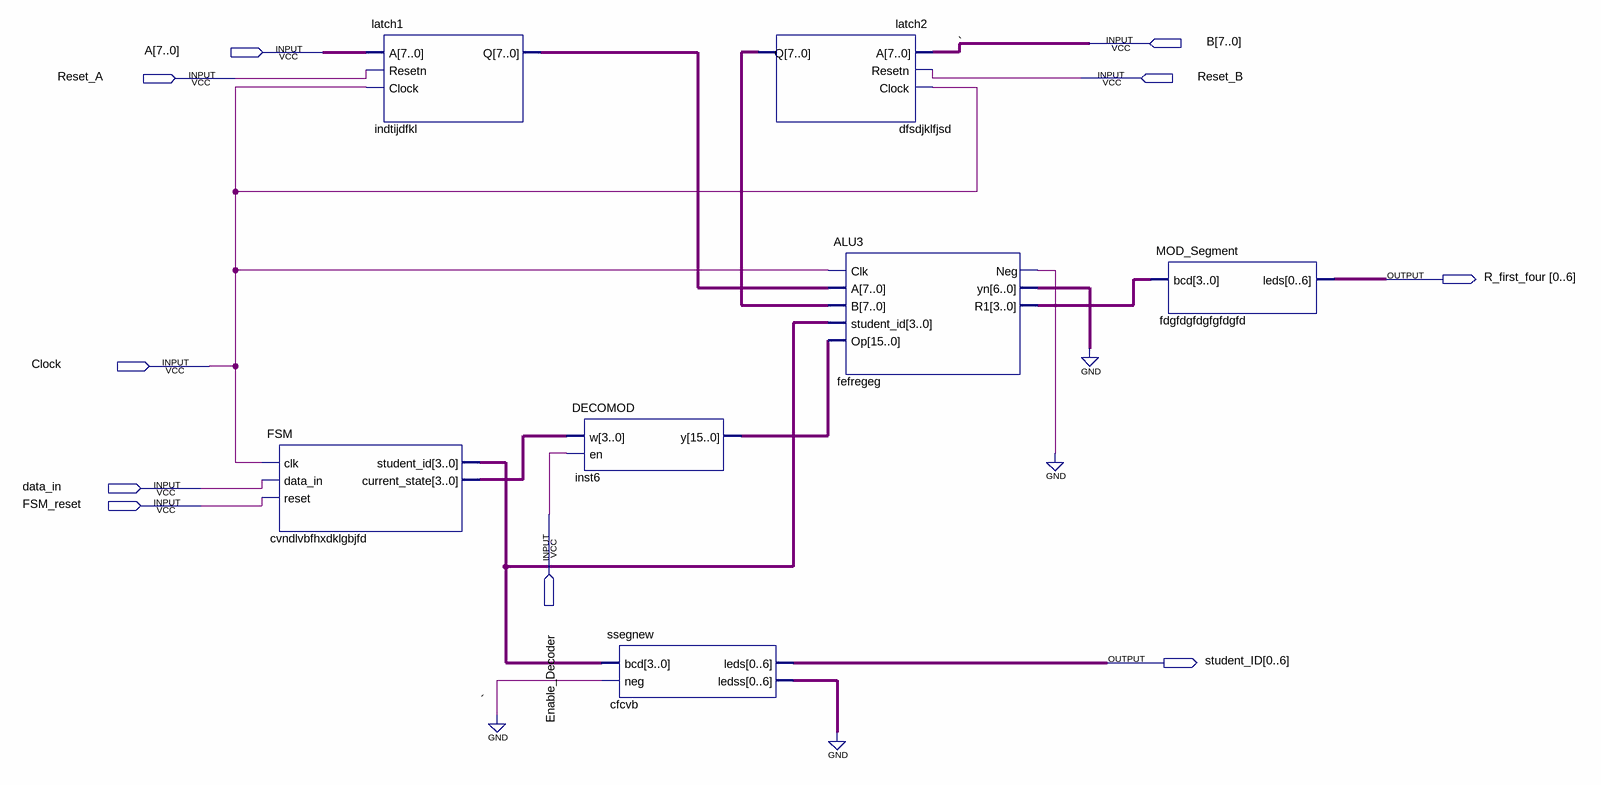
[diagram p0: schematic sheet]
// Quartus schematic ALUpart3diagram.bdf as structural Verilog: 7 symbols, 10 pins
module ALUpart3diagram (
  input  [7:0] B,
  input  [7:0] A,
  input  Reset_A,
  input  Reset_B,
  input  Clock,
  input  data_in,
  input  FSM_reset,
  input  Enable_Decoder,
  output [0:6] R_first_four,
  output [0:6] student_ID
);

  wire fefregeg_neg;
  wire [3:0] cvndlvbfhxdklgbjfd_current_state, cvndlvbfhxdklgbjfd_student_id, fefregeg_r1;
  wire [6:0] cfcvb_ledss, fefregeg_yn;
  wire [7:0] dfsdjklfjsd_q, indtijdfkl_q;
  wire [15:0] inst6_y;

  FSM cvndlvbfhxdklgbjfd (
    .clk(Clock), .data_in(data_in), .reset(FSM_reset), .student_id(cvndlvbfhxdklgbjfd_student_id),
    .current_state(cvndlvbfhxdklgbjfd_current_state));
  latch1 indtijdfkl (.A(A), .Resetn(Reset_A), .Clock(Clock), .Q(indtijdfkl_q));
  DECOMOD inst6 (.w(cvndlvbfhxdklgbjfd_current_state), .en(Enable_Decoder), .y(inst6_y));
  ssegnew cfcvb (.bcd(cvndlvbfhxdklgbjfd_student_id), .neg(1'b0), .leds(student_ID), .ledss(cfcvb_ledss));
  latch2 dfsdjklfjsd (.A({8{1'b0}}), .Resetn(Reset_B), .Clock(Clock), .Q(dfsdjklfjsd_q));
  ALU3 fefregeg (
    .Clk(Clock), .A(indtijdfkl_q), .B(dfsdjklfjsd_q), .student_id(cvndlvbfhxdklgbjfd_student_id),
    .Op(inst6_y), .Neg(fefregeg_neg), .yn(fefregeg_yn), .R1(fefregeg_r1));
  MOD_Segment fdgfdgfdgfgfdgfd (.bcd(fefregeg_r1), .leds(R_first_four));
  // also tied to GND on the sheet: {cfcvb_ledss[0], cfcvb_ledss[1], cfcvb_ledss[2], cfcvb_ledss[3], cfcvb_ledss[4], cfcvb_ledss[5], cfcvb_ledss[6], fefregeg_neg, fefregeg_yn[0], fefregeg_yn[1], fefregeg_yn[2], fefregeg_yn[3], fefregeg_yn[4], fefregeg_yn[5], fefregeg_yn[6]}
endmodule
